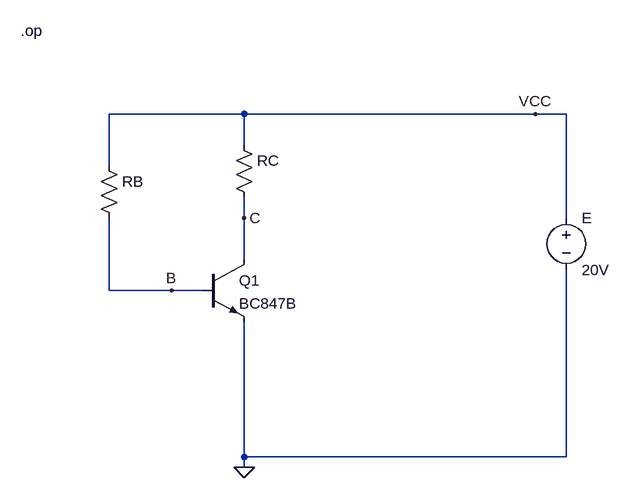
[diagram p0: schematic Schema de polarizare TB.asc]
Schema de polarizare TB.asc, the LTspice schematic file:
Version 4.1
SHEET 1 880 680
WIRE 208 -112 0 -112
WIRE 656 -112 208 -112
WIRE 704 -112 656 -112
WIRE 208 -64 208 -112
WIRE 0 -32 0 -112
WIRE 208 48 208 16
WIRE 704 48 704 -112
WIRE 208 112 208 48
WIRE 0 160 0 48
WIRE 96 160 0 160
WIRE 144 160 96 160
WIRE 208 416 208 208
WIRE 704 416 704 128
WIRE 704 416 208 416
WIRE 208 432 208 416
FLAG 208 432 0
FLAG 96 160 B
FLAG 656 -112 VCC
FLAG 208 48 C
SYMBOL npn 144 112 R0
SYMATTR InstName Q1
SYMATTR Value BC847B
SYMBOL res -16 -48 R0
WINDOW 3 36 68 Left 2
SYMATTR Value ""
SYMATTR InstName RB
SYMBOL res 192 -80 R0
WINDOW 3 36 68 Left 2
SYMATTR Value ""
SYMATTR InstName RC
SYMBOL voltage 704 32 R0
SYMATTR InstName E
SYMATTR Value 20V
TEXT -136 -240 Left 2 !.op

The netlist it stands for:
* Schema de polarizare TB.asc
Q1 C B 0 0 BC847B
RB VCC B
RC VCC C
V§E VCC 0 20V
.model NPN NPN
.model PNP PNP
.lib standard.bjt
.op
.backanno
.end

* Results of the author's LTspice run, read from the files saved beside the schematic
* Operating Point:
*   V(b) = 654.3 mV
*   V(c) = 9.543 V
*   V(vcc) = 20 V
*   I(E) = -2.097 mA
*   I(RB) = 6.141 µA
*   I(RC) = 2.091 mA
*   Ib(Q1) = 6.141 µA
*   Ic(Q1) = 2.091 mA
*   Ie(Q1) = -2.097 mA
*   Is(Q1) = 0 A